# EAGLE design Cansat2019_1516_PayloadB_v3 (EAGLE 7.3.0)
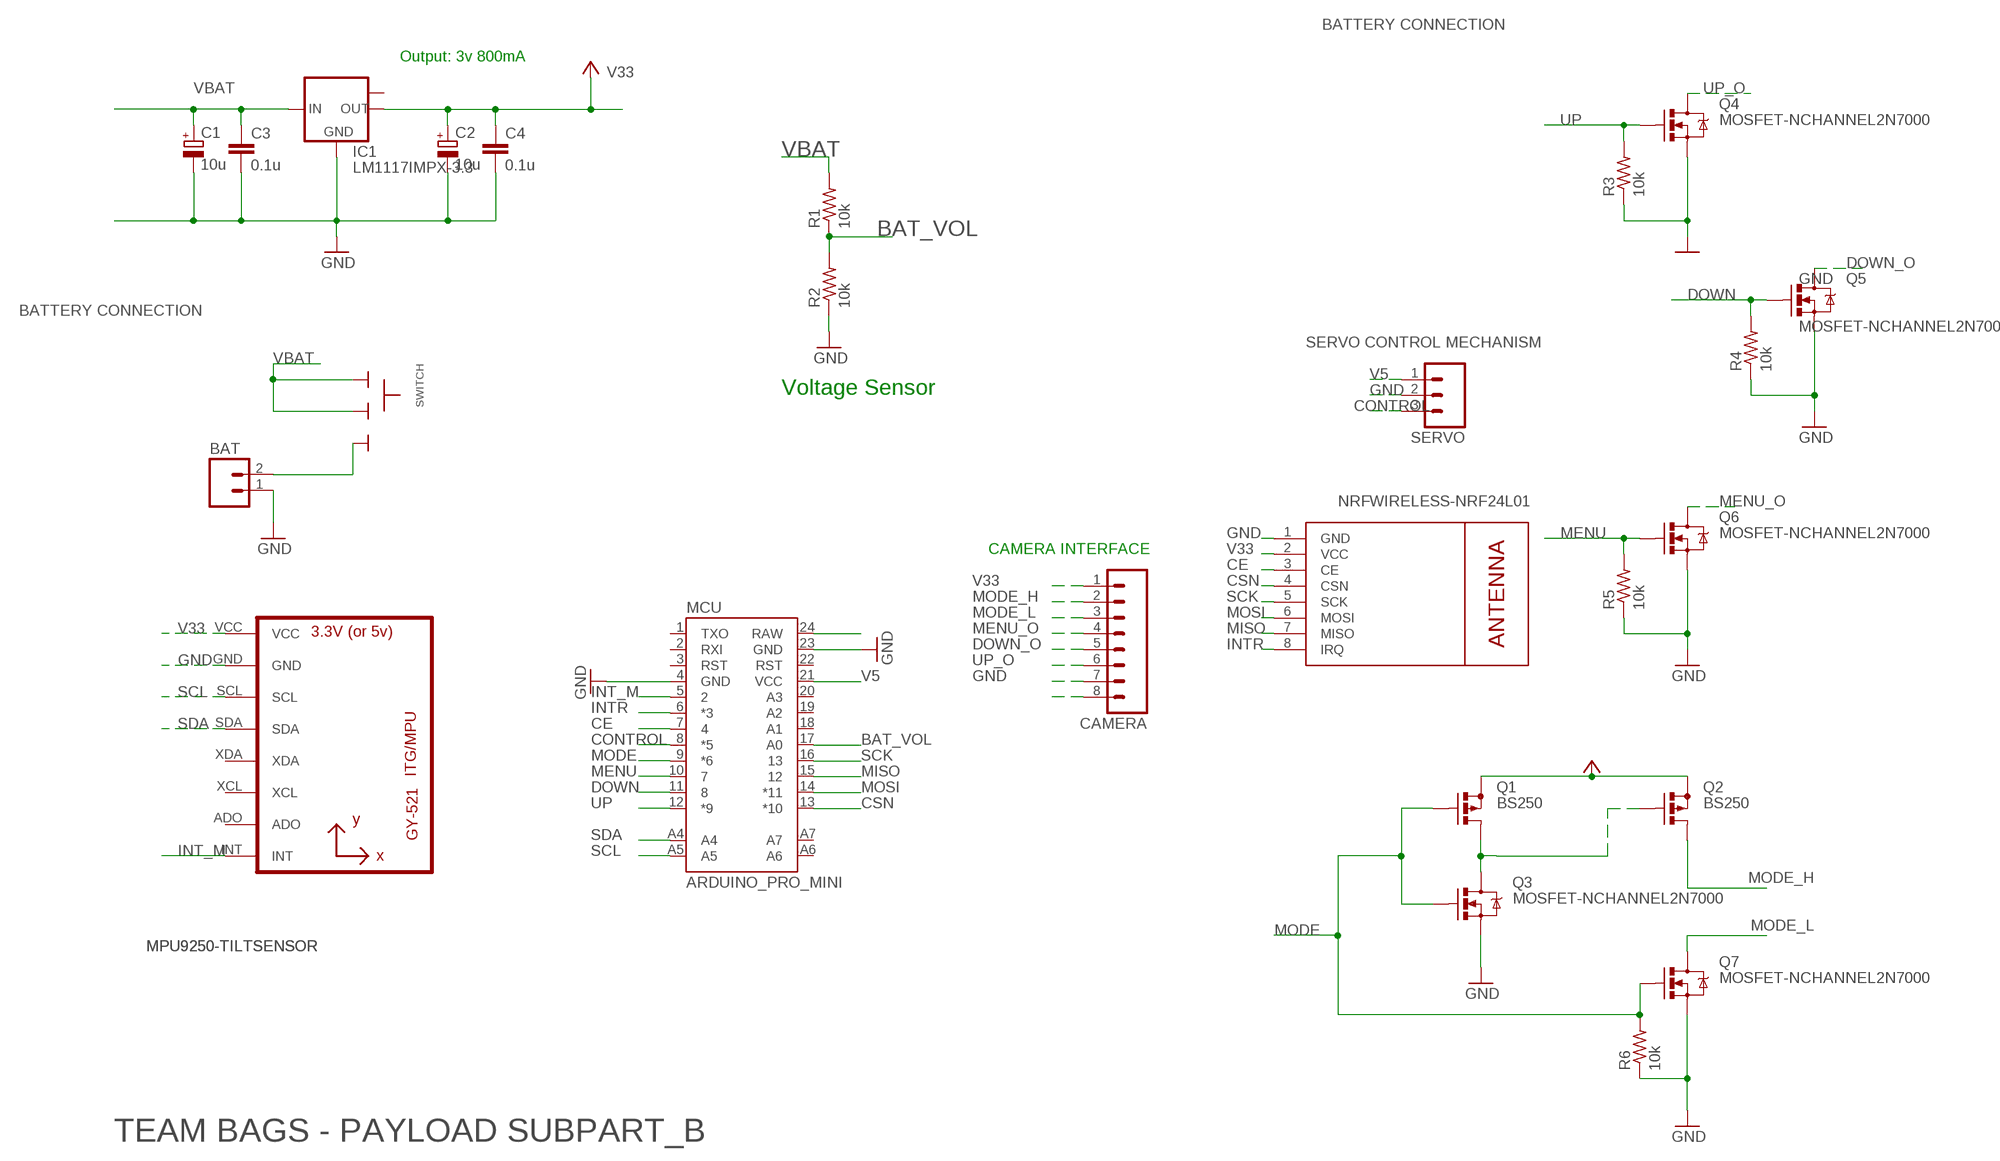
[diagram p0: schematic, sheet 1]

## Parts
BAT  M02  [02P]
C1  10u  CPOL-EUCT3528  [CT3528]
C2  10u  CPOL-EUCT3528  [CT3528]
C3  0.1u  C-EUC0805  [C0805]
C4  0.1u  C-EUC0805  [C0805]
CAMERA  M08  [08P]
IC1  LM1117IMPX-3.3  [SOT223]
MCU  ARDUINO_PRO_MINI  [ARDUINO_PRO_MINI]
MPU  GY-521MPU6050  [GY-521]
NRF  WIRELESS-NRF24L01  [WIRELESS-NRF24L01]
Q1  BS250  [SOT54E]
Q2  BS250  [SOT54E]
Q3  MOSFET-NCHANNEL2N7000  [TO-92]
Q4  MOSFET-NCHANNEL2N7000  [TO-92]
Q5  MOSFET-NCHANNEL2N7000  [TO-92]
Q6  MOSFET-NCHANNEL2N7000  [TO-92]
Q7  MOSFET-NCHANNEL2N7000  [TO-92]
R1  10k  RESISTOR0805  [R0805]
R2  10k  RESISTOR0805  [R0805]
R3  10k  RESISTOR0805  [R0805]
R4  10k  RESISTOR0805  [R0805]
R5  10k  RESISTOR0805  [R0805]
R6  10k  RESISTOR0805  [R0805]
SERVO  M03  [03P]
SWITCH  SLIDESWITCH-BIG  [BIGSWITCH]

## Nets
BAT_VOL: MCU.17(A0) R1.1 R2.2
CE: MCU.7 NRF.3(CE)
CONTROL: MCU.8(*5) SERVO.3
CSN: MCU.13(*10) NRF.4(CSN)
DOWN: MCU.11 Q5.2(G) R4.2
DOWN_O: CAMERA.5 Q5.3(D)
GND [power]: BAT.1 C1.- C2.- C3.2 C4.2 CAMERA.7 IC1.1(GND) MCU.4(GND) MCU.23(GND) MPU.GND NRF.1(GND) Q3.1(S) Q4.1(S) Q5.1(S) Q6.1(S) Q7.1(S) R2.1 R3.1 R4.1 R5.1 R6.1 SERVO.2
INT_M: MCU.5 MPU.INT
INTR: MCU.6(*3) NRF.8(IRQ)
MENU: MCU.10 Q6.2(G) R5.2
MENU_O: CAMERA.4 Q6.3(D)
MISO: MCU.15 NRF.7(MISO)
MODE [power]: MCU.9(*6) Q1.G Q3.2(G) Q7.2(G) R6.2
MODE_H [power]: CAMERA.2 Q2.D
MODE_L: CAMERA.3 Q7.3(D)
MOSI: MCU.14(*11) NRF.6(MOSI)
N$1 [power_main]: BAT.2 SWITCH.3
N$2: Q1.D Q2.G Q3.3(D)
N$3: MCU.24(RAW)
N$11: CAMERA.8
SCK: MCU.16 NRF.5(SCK)
SCL: MCU.A5 MPU.SCL
SDA: MCU.A4 MPU.SDA
UP: MCU.12(*9) Q4.2(G) R3.2
UP_O: CAMERA.6 Q4.3(D)
V5 [power]: MCU.21(VCC) SERVO.1
V33 [power]: C2.+ C4.1 CAMERA.1 IC1.2(OUT) MPU.VCC NRF.2(VCC) ; supply symbol labelled VCC
VBAT [power_main]: C1.+ C3.1 IC1.3(IN) R1.2 SWITCH.1 SWITCH.2
VCC [power]: Q1.S Q2.S
Unconnected: IC1.TAB(OUT1) MCU.1(TXO) MCU.2(RXI) MCU.3(RST) MCU.18(A1) MCU.19(A2) MCU.20(A3) MCU.22(RST) MCU.A6 MCU.A7 MPU.ADO MPU.XCL MPU.XDA

## Notes on the sheet
- BATTERY CONNECTION
- Output: 3v 800mA
- BATTERY CONNECTION
- SERVO CONTROL MECHANISM
- Voltage Sensor
- CAMERA INTERFACE
- MPU9250-TILTSENSOR | MPU9250-TILTSENSOR
- TEAM BAGS - PAYLOAD SUBPART_B

## Library data of the parts
BAT = CEDT_JANUARY_2015_v5:M02: AMP QUICK CONNECTOR
C1 C2 = rcl:CPOL-EU: POLARIZED CAPACITOR, European symbol
C3 C4 = rcl:C-EU: CAPACITOR, European symbol
CAMERA = con-amp-quick:M08: AMP QUICK CONNECTOR; OC_FARNELL: unknown; OC_NEWARK: unknown
IC1 = lm1117:LM1117IMPX-*
MCU = SparkFun-Boards - Copy:ARDUINO_PRO_MINI
MPU = gy-521:GY-521
NRF = diy-modules:WIRELESS-NRF24L01: 2.4 GHz Wireless Module based on NRF24L01 chip More details available here: http://www.electrodragon.com/w/NRF24L01 Click here to find device on ebay.com <http://www.ebay.com/sch/nrf24l01+arduino>
Q1 Q2 = transistor-small-signal:BS250: P-CHANNEL MOS FET
Q3-Q7 = SparkFun-DiscreteSemi:MOSFET-NCHANNEL: Common NMOSFET Parts MFG P/N Store ID Prod ID FDD8780 TRANS-09984 SI7820DN TRANS-11055 FDS6630A IC-08089 2N7002PW TRANS-11151 FQP30N06L COM-10213 TRANS-10060 BSS123LT1G TRANS-08345 BSS138 TRANS-00830 BS170 2N7000
R1-R6 = CEDT_JANUARY_2015_v5:RESISTOR
SERVO = con-amp-quick:M03: AMP QUICK CONNECTOR; OC_FARNELL: unknown; OC_NEWARK: unknown
SWITCH = CEDT_JANUARY_2015_v5:SLIDESWITCH

## Net classes
0 default: width 0.305 mm
1 power: width 0.61 mm, clearance 0.305 mm
2 power_main: width 0.813 mm, clearance 0.356 mm

## Board
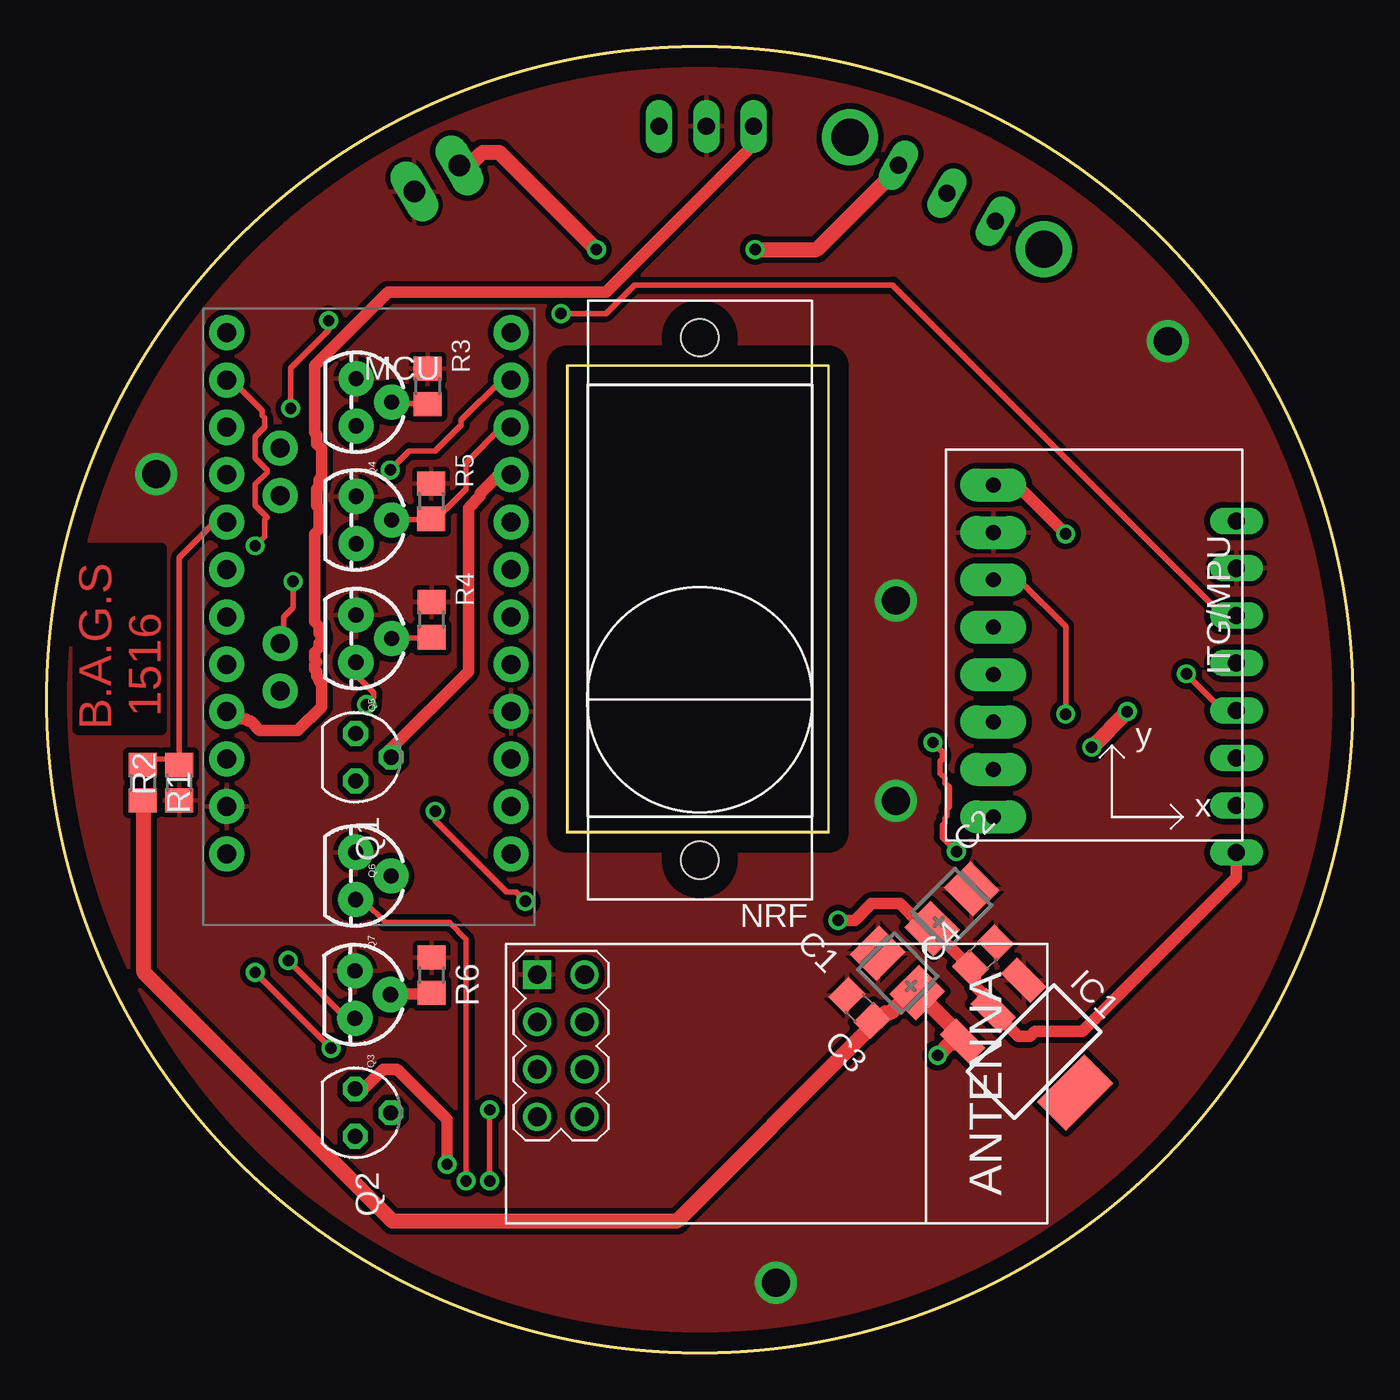
[diagram p1: board, top side]
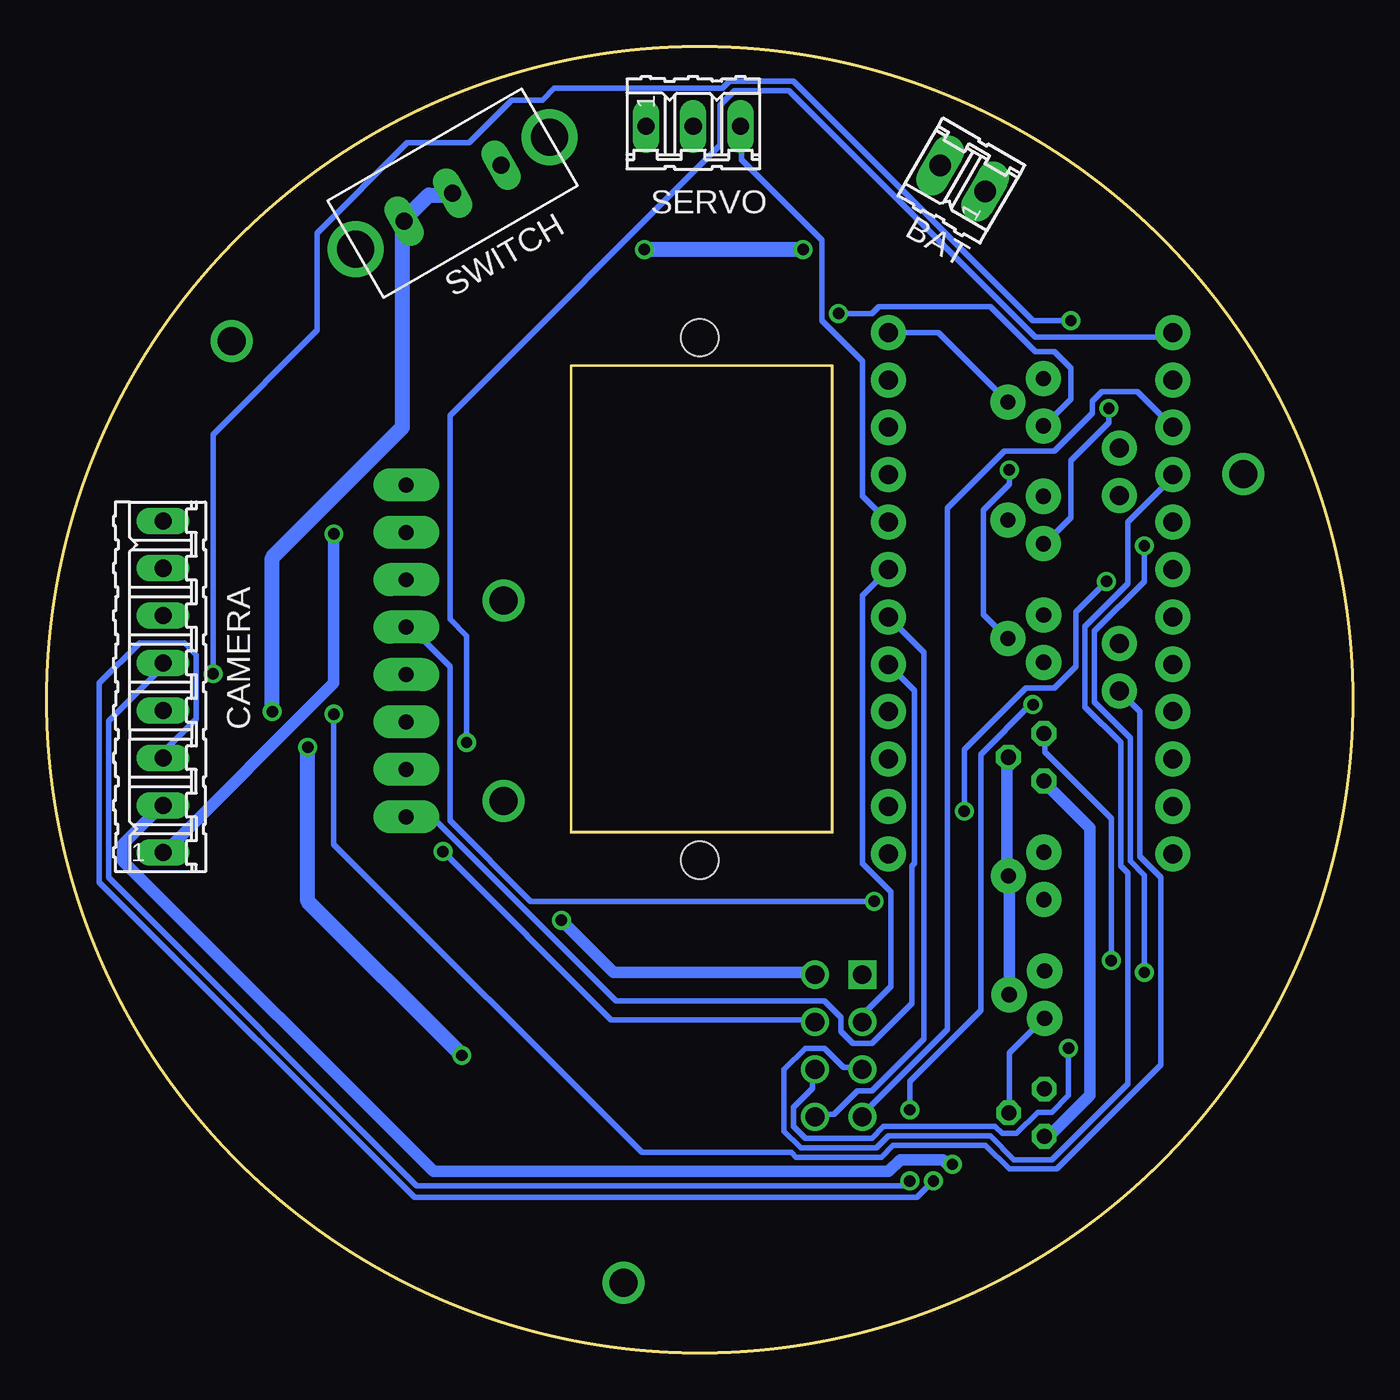
[diagram p2: board, bottom side, seen from below]

Size 70 x 70 mm. Coordinates in mm from the lower left corner, seen from the top.
Outline: circle at 35,35 radius 35
Copper layers (1*16): Top 0.035mm / dielectric 1.5mm / Bottom 0.035mm
Design rules "default": minimum track width 10mil, minimum drill 24mil, track to track 8mil, track to pad 8mil, pad to pad 8mil, via to via 8mil, smd to smd 8mil, copper to edge 40mil, drill to drill 8mil, minimum pad ring 10mil, minimum via ring 8mil, stop-mask expansion 4mil, vias tented up to drill 0mil, thermal gap 10mil
Milling: area 27.9,27.9 to 41.9,52.9

### Footprints (pad centres in the part's own frame; a part is rotated, then mirrored left to right if it is on the bottom)
02P = drill 1.143 long: 1 -1.397,0; 2 1.397,0
CT3528 = smd 2 x 2.2: + -1.5,0; - 1.5,0
C0805 = smd 1.3 x 1.5: 1 -0.95,0; 2 0.95,0
08P = drill 0.914 long: 1 -8.89,0; 2 -6.35,0; 3 -3.81,0; 4 -1.27,0; 5 1.27,0; 6 3.81,0; 7 6.35,0; 8 8.89,0
SOT223 = smd 1.219 x 2.235: 1 -2.311,-3.099; 2 0,-3.099; 3 2.311,-3.099 | smd 3.6 x 2.2: TAB 0,3.099
ARDUINO_PRO_MINI = drill 1.016 pad 1.88: 1 -7.62,12.7; 2 -7.62,10.16; 3 -7.62,7.62; 4 -7.62,5.08; 5 -7.62,2.54; 6 -7.62,0; 7 -7.62,-2.54; 8 -7.62,-5.08; 9 -7.62,-7.62; 10 -7.62,-10.16; 11 -7.62,-12.7; 12 -7.62,-15.24; 13 7.62,-15.24; 14 7.62,-12.7; 15 7.62,-10.16; 16 7.62,-7.62; 17 7.62,-5.08; 18 7.62,-2.54; 19 7.62,0; 20 7.62,2.54; 21 7.62,5.08; 22 7.62,7.62; 23 7.62,10.16; 24 7.62,12.7; A4 4.763,1.429; A5 4.763,3.969; A6 4.763,-9.049; A7 4.763,-6.509
GY-521 = drill 0.8 pad 1.778 long: ADO -8.89,-6.35; GND -8.89,6.35; INT -8.89,-8.89; SCL -8.89,3.81; SDA -8.89,1.27; VCC -8.89,8.89; XCL -8.89,-3.81; XDA -8.89,-1.27
WIRELESS-NRF24L01 = drill 1 square: 1 -12.7,6.35 | drill 1: 2 -10.16,6.35; 3 -12.7,3.81; 4 -10.16,3.81; 5 -12.7,1.27; 6 -10.16,1.27; 7 -12.7,-1.27; 8 -10.16,-1.27
SOT54E = drill 0.813 octagon: D -1.27,0; G 0,1.905; S 1.27,0
TO-92 = drill 0.813 pad 1.88: 1 -1.27,0; 2 0,1.905; 3 1.27,0
R0805 = smd 1.3 x 1.5: 1 -0.95,0; 2 0.95,0
03P = drill 0.914 long: 1 -2.54,0; 2 0,0; 3 2.54,0
BIGSWITCH = drill 0.9 long: 1 -3,0; 2 0,0; 3 3,0 | drill 2 pad 2.184: TAB1 -6,0; TAB2 6,0
SG90_TOP = hole 2: 4.1,26.5; 4.1,-1.5

### Placement (x,y rotation side)
BAT  20.91,62.93 150 bottom
C1  45.6,20.36 135 top
C2  48.51,23.8 45 top
C3  43.56,18.48 135 top
C4  50.19,21.31 45 top
CAMERA  63.76,35.7 90 bottom
IC1  52.92,16.14 225 top
MCU  17.27,39.44 180 top
MPU  59.62,37.62 0 top
NRF  38.99,13.92 0 top
Q1  16.55,31.92 270 top
Q2  16.54,12.87 270 top
Q3  16.52,19.2 270 top
Q4  16.58,50.94 270 top
Q5  16.57,38.28 270 top
Q6  16.58,44.63 270 top
Q7  16.55,25.56 270 top
R1  5.15,30.55 270 top
R2  7.11,30.55 90 top
R3  20.42,51.79 270 top
R4  20.62,39.29 270 top
R5  20.61,45.64 270 top
R6  20.62,20.24 270 top
SERVO  35.35,65.73 0 bottom
SWITCH  48.25,62.15 30 bottom
U$1  [SG90_TOP]  30.9,27.9 0 top

### Tracks (layer width: path | path; a pad name or v marks a point on that pad's centre or on a via)
BAT_VOL
  Top 0.305: 7.11,31.82 5.2,31.82 R1.1 | MCU.17 9.01,44.52 7.11,42.62 7.11,31.82 | 7.11,31.82 R2.2
CE
  Bottom 0.305: MCU.7 26.29,40.58 26.29,26.23 24.76,24.71 24.76,19.63 26.29,18.1 26.29,17.85 NRF.3
CONTROL
  Bottom 0.305: MCU.8 26.29,45.92 26.29,53.16 28.45,55.31 28.45,59.63 32.76,63.95 32.76,65.73 SERVO.3
CSN  (via drill 0.61)
  Top 0.305: v48.77,26.87 48,27.63 48,28.26 48.13,28.39 48.13,28.64 48.26,28.77 48.26,29.15 48.39,29.28 48.39,30.3 48.13,30.55 48.13,30.8 47.88,31.06 47.88,31.69 48,31.82 48,32.2 v47.5,32.71
  Bottom 0.305: v48.77,26.87 39.75,17.85 28.95,17.85 NRF.4 | v47.5,32.71 47.5,38.42 48.39,39.31 48.39,50.23 33.91,64.71 33.91,66.87 33.14,67.63 30.22,67.63 17.02,54.43 9.9,54.43 MCU.13
DOWN  (via drill 0.61)
  Top 0.305: R4.2 20.57,38.3 18.54,38.3 Q5.2 | MCU.11 24.38,52.14 22.22,49.98 22.22,49.73 20.83,48.33 19.43,48.33 v18.41,47.31
  Bottom 0.305: v18.41,47.31 18.41,46.55 19.81,45.16 19.81,39.57 18.54,38.3 Q5.2
DOWN_O  (via drill 0.61)
  Top 0.305: v23.75,13.02 v23.75,9.21 | v17.14,34.74 17.52,35.12 17.52,35.38 16.63,36.27 16.63,36.9 Q5.3
  Bottom 0.305: v23.75,9.21 24,8.96 50.16,8.96 66.67,25.47 66.67,33.85 63.88,36.65 63.88,36.9 CAMERA.5 | v23.75,13.02 23.75,14.55 19.94,18.36 19.94,32.07 17.27,34.74 v17.14,34.74
GND  (via drill 1.5)
  other vias: 39.09,3.75 5.87,47.09 60.09,54.22 45.51,40.33 45.51,29.58
  pour Top: -1.78,72.46 75.69,72.46 75.69,-2.47 -1.78,-2.47
INT_M
  Bottom 0.305: MCU.5 23.49,35.5 23.49,26.23 23.62,26.1 23.62,18.74 25.78,16.58 26.79,16.58 27.43,17.21 27.43,17.98 28.32,18.87 39.49,18.87 49.27,28.64 50.67,28.64 MPU.INT
INTR
  Bottom 0.305: MCU.6 22.98,37.53 22.98,16.83 25.78,14.04 26.54,14.04 27.81,12.77 28.83,12.77 NRF.8
MENU
  Top 0.305: Q6.2 18.54,44.65 20.57,44.65 R5.2 20.7,44.77 20.95,44.77 22.48,46.3 22.48,47.7 24.38,49.6 MCU.10
MENU_O  (via drill 0.61)
  Top 0.305: v61.08,36.39 62.99,34.49 63.75,34.49 CAMERA.4 | v15.11,55.31 15.11,54.81 13.08,52.77 v13.08,50.62
  Bottom 0.305: v61.08,36.39 61.08,49.22 55.5,54.81 55.5,60.01 50.67,64.84 47.37,64.84 45.08,67.13 43.43,67.13 42.8,67.76 33.78,67.76 33.4,68.14 29.97,68.14 17.14,55.31 v15.11,55.31 | v13.08,50.62 13.08,49.85 15.11,47.82 15.11,44.77 16.51,43.38 Q6.3
MISO
  Bottom 0.305: MCU.15 11.55,51.5 13.46,51.5 13.97,51 13.97,50.36 16,48.33 18.67,48.33 21.71,45.28 21.71,17.34 26.29,12.77 NRF.7
MODE
  Top 0.61: R6.2 20.57,19.25 18.54,19.25 Q3.2 | MCU.9 24.25,47.06 23.24,46.04 23.24,45.92 22.6,45.28 22.6,36.52 18.41,32.33 18.41,31.95 Q1.G
  Bottom 0.61: Q1.G 18.54,31.82 18.54,25.6 Q7.2 18.41,25.34 18.41,19.25 Q3.2
MODE_H  (via drill 0.61)
  Top 0.61: v21.46,10.1 21.46,12.52 18.79,15.18 18.03,15.18 17.02,14.17 16.63,14.17 Q2.D
  Bottom 0.61: v21.46,10.1 21.71,10.1 21.97,10.36 24.25,10.36 24.89,9.72 49.27,9.72 65.91,26.36 65.91,27.25 63.88,29.28 CAMERA.2
MODE_L  (via drill 0.61)
  Top 0.305: v22.48,9.21 22.48,22.17 21.59,23.06 18.16,23.06 17.02,24.2 16.63,24.2 Q7.3
  Bottom 0.305: v22.48,9.21 23.37,8.32 50.29,8.32 67.18,25.22 67.18,35.88 65.02,38.04 62.61,38.04 61.97,37.41 61.97,33.98 63.75,32.2 63.75,31.95 CAMERA.3
MOSI  (via drill 0.61)
  Top 0.305: v11.17,20.39 v15.24,16.33 | v11.17,43.25 11.68,43.76 11.68,44.65 11.81,44.77 11.17,45.41 11.17,46.55 11.81,47.19 11.81,47.31 11.17,47.95 11.17,49.09 11.68,49.6 11.68,50.11 11.55,50.23 11.55,50.49 9.9,52.14 MCU.14
  Bottom 0.305: v15.24,16.33 15.24,13.79 16.13,12.9 16.89,12.9 18.03,11.75 18.79,11.75 19.17,12.13 25.14,12.13 25.78,11.5 29.33,11.5 29.97,12.13 29.97,13.15 28.95,14.17 28.95,15.18 NRF.6 | v11.17,20.39 11.17,25.6 11.94,26.36 11.94,32.96 13.84,34.87 13.84,38.68 11.17,41.34 v11.17,43.25
N$1  (via drill 0.61)
  Top 0.813: v37.97,59.12 41.27,59.12 45.08,62.93 45.08,63.06 45.59,63.57 SWITCH.3 | v29.46,59.12 24.25,64.33 23.37,64.33 22.6,63.57 22.22,63.57 BAT.2
  Bottom 0.813: v29.46,59.12 v37.97,59.12
N$2  (via drill 0.61)
  Top 0.305: v12.95,21.02 16,17.98 16.51,17.98 Q3.3
  Bottom 0.305: Q2.G 18.41,12.9 18.41,16.07 16.63,17.85 Q3.3 | v12.95,21.02 12.95,28.64 16.51,32.2 16.51,33.09 Q1.D
SCK
  Bottom 0.305: MCU.16 9.65,46.93 12.06,44.52 12.06,41.22 14.35,38.93 14.35,34.61 12.44,32.71 12.44,26.1 12.06,25.72 12.06,14.42 16.13,10.36 18.16,10.36 19.43,11.63 24.89,11.63 25.52,10.99 29.59,10.99 30.48,11.88 30.48,15.18 29.33,16.33 28.32,16.33 27.3,15.31 26.41,15.31 NRF.5
SCL  (via drill 0.61)
  Top 0.305: v54.61,34.23 54.61,38.93 52.19,41.34 50.8,41.34 MPU.SCL
  Bottom 0.305: v54.61,34.23 54.61,27.25 38.1,10.74 30.1,10.74 29.84,10.48 25.27,10.48 24.64,11.12 19.68,11.12 18.41,9.85 15.87,9.85 10.28,15.44 10.28,25.47 11.43,26.61 11.43,34.36 12.44,35.38 MCU.A5
SDA  (via drill 0.61)
  Top 0.305: v25.65,24.2 25.14,24.71 24.64,24.71 20.83,28.52 v20.83,29.03 | v13.21,41.34 13.21,39.95 12.7,39.44 12.7,38.93 12.57,38.8 12.57,38.04 MCU.A4
  Bottom 0.305: v25.65,24.2 44.07,24.2 48.39,28.52 48.39,36.77 50.42,38.8 50.67,38.8 MPU.SDA | v20.83,29.03 20.83,32.33 17.52,35.63 16,35.63 14.86,36.77 14.86,39.69 v13.21,41.34
UP
  Top 0.305: R3.2 20.32,50.87 18.54,50.87 Q4.2
  Bottom 0.305: MCU.12 22.22,54.68 18.54,51 Q4.2
UP_O  (via drill 0.61)
  Top 0.305: v27.56,55.7 29.97,55.7 31.49,57.22 45.34,57.22 62.99,39.57 63.75,39.57 CAMERA.6
  Bottom 0.305: v27.56,55.7 25.78,55.7 25.4,56.08 19.43,56.08 17.02,53.66 16,53.66 15.11,52.77 15.11,51.12 16.51,49.73 Q4.3
V5
  Top 0.61: MCU.21 10.03,34.36 10.41,33.98 10.67,33.98 10.79,33.85 10.92,33.85 11.43,33.34 13.46,33.34 14.73,34.61 14.73,35.88 14.6,36.01 14.6,36.14 14.48,36.27 14.48,36.52 14.35,36.65 14.35,36.9 14.48,37.03 14.35,37.15 14.35,37.53 14.6,37.79 14.6,38.04 14.73,38.17 14.73,38.42 14.6,38.55 14.6,38.93 14.35,39.19 14.35,43.88 14.6,44.14 14.6,45.28 14.48,45.41 14.48,46.3 14.6,46.42 14.6,46.81 14.73,46.93 14.73,48.46 14.48,48.71 14.48,49.22 14.35,49.35 14.35,52.9 18.29,56.84 29.97,56.84 37.84,64.71 37.84,65.73 SERVO.1
V33  (via drill 0.61)
  Top 0.61: CAMERA.1 63.75,26.74 63.75,25.47 55.5,17.21 52.96,17.21 52.7,16.96 52.07,16.96 50.92,18.1 IC1.2 50.67,18.36 50.67,18.74 49.78,19.63 49.78,20.01 49.53,20.26 49.53,20.52 C4.1 49.4,20.77 47.5,22.68 C2.+ 47.24,22.93 46.86,22.93 45.72,24.07 44.19,24.07 43.3,23.18 v42.42,23.18 | v54.61,43.88 52.07,46.42 50.8,46.42 MPU.VCC
  Bottom 0.61: v42.42,23.18 39.62,20.39 28.95,20.39 NRF.2 | v54.61,43.88 54.61,35.88 63.75,26.74 CAMERA.1
VBAT  (via drill 0.61)
  Top 0.813: R1.2 5.2,29.28 5.2,20.39 18.54,7.05 33.78,7.05 43.94,17.21 C3.1 44.32,17.85 44.58,17.85 44.96,18.23 45.21,18.23 46.23,19.25 46.61,19.25 C1.+ 46.86,19.12 49.02,16.96 49.02,16.71 IC1.3 49.02,16.58 48.39,16.58 v47.75,15.94 | v56,32.45 v57.91,34.36
  Bottom 0.813: SWITCH.2 48.26,62.05 49.53,62.05 50.8,60.78 SWITCH.1 50.92,60.39 50.92,49.6 57.91,42.62 v57.91,34.36 | v56,32.45 56,24.2 v47.75,15.94
VCC
  Bottom 0.61: Q2.S 16.51,11.63 16.25,11.63 14.09,13.79 14.09,28.14 16.51,30.55 Q1.S

### Text on the board
Top: B.A.G.S / 1516
tStop: B.A.G.S / 1516